# Altium project AFE_mezzanine.PrjPCB
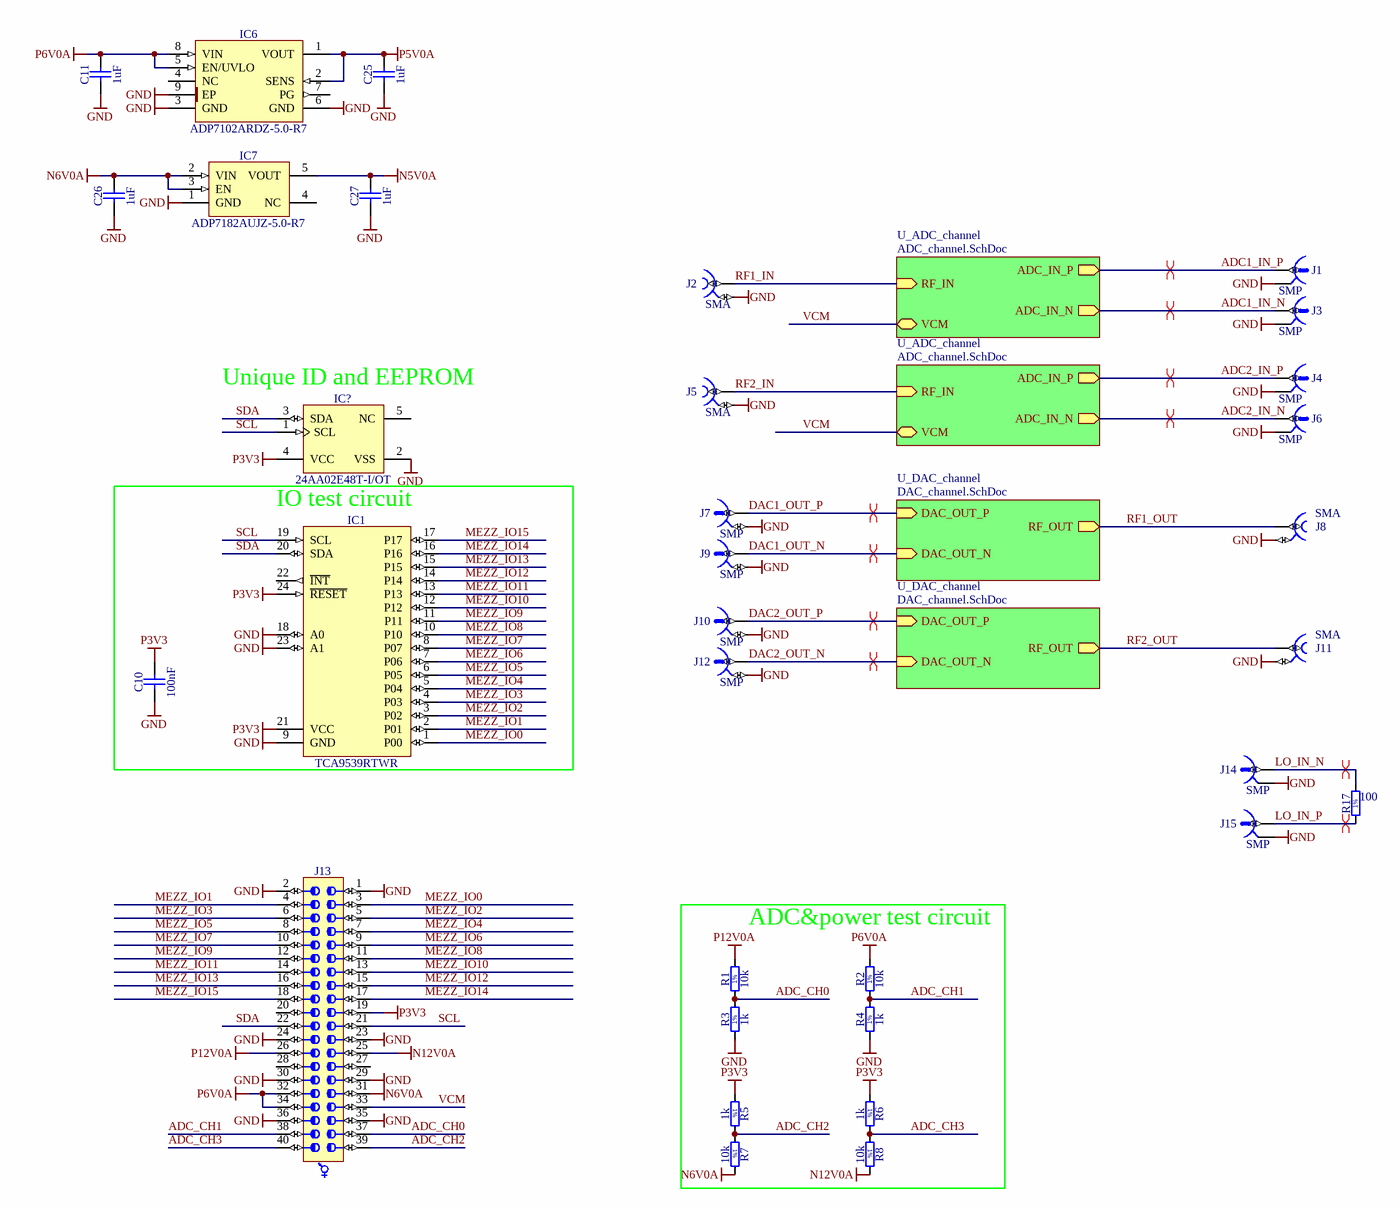
[diagram p0: AFE_mezzanine.SchDoc]
3 sheets, 73 parts. Net scope: hierarchical (ports join the sheet entries above them; power ports are global).
Board file: AFE_mezzanine.PcbDoc
Sheets:
  AFE_mezzanine.SchDoc
    U_ADC_channel = ADC_channel.SchDoc
    U_DAC_channel = DAC_channel.SchDoc
    U_ADC_channel = ADC_channel.SchDoc
    U_DAC_channel = DAC_channel.SchDoc

## Sheet AFE_mezzanine.SchDoc: ADC/DAC mezzanine
size 420 x 297 mm; Author: G.K.; CompanyName: WUT; DrawnBy: G.K.; Organization: CERN; Address1: Warsaw Univeristy of Technology; Address2: Nowowiejska 15/19; Revision: -; SheetNumber: -; SheetTotal: -; EDA_Number: ARTIQ; Projet: ADC/DAC MEZZANINE; ModifiedBy: -; CreateDate: XX/XX/XXXX; CheckedDate: -; Title2: Top entity; DivGrp: ISE; Designer: G.K.; ModifiedDate: -; ProjectName: ADC/DAC MEZZANINE

### Parts
C10  100nF  [CAPC1005X55N]
C11  1uF  [CAPC2012X140N]
C25  1uF  [CAPC2012X140N]
C26  1uF  [CAPC2012X140N]
C27  1uF  [CAPC2012X140N]
IC1  TCA9539RTWR  [QFN50P400X400X80-25N-S255]
IC6  ADP7102ARDZ-5.0-R7  [SOIC127P600X175-9N-R241X309]
IC7  ADP7182AUJZ-5.0-R7  [SOT95P280X90-5N]
IC?  24AA02E48T-I/OT  [SOT95P280X145-5N]
J1  SMP  [AMPHENOL_SMP-MSLD-PCT-10]
J2  SMA  [Telegartner_J01151A0921]
J3  SMP  [AMPHENOL_SMP-MSLD-PCT-10]
J4  SMP  [AMPHENOL_SMP-MSLD-PCT-10]
J5  SMA  [Telegartner_J01151A0921]
J6  SMP  [AMPHENOL_SMP-MSLD-PCT-10]
J7  SMP  [MOLEX_85305-0232]
J8  SMA  [TELEGARTNER_J01151A0451]
J9  SMP  [MOLEX_85305-0232]
J10  SMP  [MOLEX_85305-0232]
J11  SMA  [TELEGARTNER_J01151A0451]
J12  SMP  [MOLEX_85305-0232]
J13  (no value)  [SAMTEC_LSS-120-03-L-DV-A]
J14  SMP  [AMPHENOL_SMP-MSLD-PCT-10]
J15  SMP  [AMPHENOL_SMP-MSLD-PCT-10]
R1  10k  [RESC1005X40N]
R2  10k  [RESC1005X40N]
R3  1k  [RESC1005X40N]
R4  1k  [RESC1005X40N]
R5  1k  [RESC1005X40N]
R6  1k  [RESC1005X40N]
R7  10k  [RESC1005X40N]
R8  10k  [RESC1005X40N]
R17  100  [RESC1005X40N]

### Blocks framed on the sheet
IO test circuit: C10 IC1
ADC&power test circuit: R1-R8

### Sub-sheets
U_ADC_channel = ADC_channel.SchDoc: ADC_IN_N (out), ADC_IN_P (out), RF_IN (in), VCM (bidir)
U_ADC_channel = ADC_channel.SchDoc: ADC_IN_P (out), ADC_IN_N (out), RF_IN (in), VCM (bidir)
U_DAC_channel = DAC_channel.SchDoc: DAC_OUT_P (in), DAC_OUT_N (in), RF_OUT (out)
U_DAC_channel = DAC_channel.SchDoc: DAC_OUT_P (in), DAC_OUT_N (in), RF_OUT (out)

### Nets
GND: C10.1 C11.1 C25.1 C26.1 C27.1 IC1.9(GND) IC1.18(A0) IC1.23(A1) IC6.3(GND) IC6.6(GND) IC6.9(EP) IC7.1(GND) IC?.2(VSS) J1.2 J2.2 J3.2 J4.2 J5.2 J6.2 J7.2 J8.2 J9.2 J10.2 J11.2 J12.2 J13.1 J13.2 J13.23 J13.24 J13.29 J13.30 J13.35 J13.36 J14.2 J15.2 R3.1 R4.1
N5V0A: C27.2 IC7.5(VOUT)
N6V0A: C26.2 IC7.2(VIN) IC7.3(EN) J13.31 R7.2
N12V0A: J13.25 R8.2
P3V3: C10.2 IC1.21(VCC) IC1.24(~{RESET}) IC?.4(VCC) J13.19 R5.1 R6.1
P5V0A: C25.2 IC6.1(VOUT) IC6.2(SENS)
P6V0A: C11.2 IC6.5(EN/UVLO) IC6.8(VIN) J13.32 J13.34 R2.2
P12V0A: J13.26 R1.2
ADC1_IN_N: J3.1 ; sheet U_ADC_channel/ADC_IN_N
ADC1_IN_P: J1.1 ; sheet U_ADC_channel/ADC_IN_P
ADC2_IN_N: J6.1 ; sheet U_ADC_channel/ADC_IN_N
ADC2_IN_P: J4.1 ; sheet U_ADC_channel/ADC_IN_P
ADC_CH0: J13.37 R1.1 R3.2
ADC_CH1: J13.38 R2.1 R4.2
ADC_CH2: J13.39 R5.2 R7.1
ADC_CH3: J13.40 R6.2 R8.1
DAC1_OUT_N: J9.1 ; sheet U_DAC_channel/DAC_OUT_N
DAC1_OUT_P: J7.1 ; sheet U_DAC_channel/DAC_OUT_P
DAC2_OUT_N: J12.1 ; sheet U_DAC_channel/DAC_OUT_N
DAC2_OUT_P: J10.1 ; sheet U_DAC_channel/DAC_OUT_P
LO_IN_N: J14.1 R17.2
LO_IN_P: J15.1 R17.1
MEZZ_IO0: IC1.1(P00) J13.3
MEZZ_IO1: IC1.2(P01) J13.4
MEZZ_IO2: IC1.3(P02) J13.5
MEZZ_IO3: IC1.4(P03) J13.6
MEZZ_IO4: IC1.5(P04) J13.7
MEZZ_IO5: IC1.6(P05) J13.8
MEZZ_IO6: IC1.7(P06) J13.9
MEZZ_IO7: IC1.8(P07) J13.10
MEZZ_IO8: IC1.10(P10) J13.11
MEZZ_IO9: IC1.11(P11) J13.12
MEZZ_IO10: IC1.12(P12) J13.13
MEZZ_IO11: IC1.13(P13) J13.14
MEZZ_IO12: IC1.14(P14) J13.15
MEZZ_IO13: IC1.15(P15) J13.16
MEZZ_IO14: IC1.16(P16) J13.17
MEZZ_IO15: IC1.17(P17) J13.18
RF1_IN: J2.1 ; sheet U_ADC_channel/RF_IN
RF1_OUT: J8.1 ; sheet U_DAC_channel/RF_OUT
RF2_IN: J5.1 ; sheet U_ADC_channel/RF_IN
RF2_OUT: J11.1 ; sheet U_DAC_channel/RF_OUT
SCL: IC1.19(SCL) IC?.1(SCL) J13.21
SDA: IC1.20(SDA) IC?.3(SDA) J13.22
VCM: J13.33 ; sheet U_ADC_channel/VCM, sheet U_ADC_channel/VCM

Not connected (* = marked no-connect by the designer): IC1 22(~{INT}); IC6 4(NC) 7(PG); IC7 4(NC); IC? 5(NC); J13 20 27 28

### Layout directives
differential pair: ADC1_IN_N, ADC1_IN_P, ADC2_IN_N, ADC2_IN_P, DAC1_OUT_N, DAC1_OUT_P, DAC2_OUT_N, DAC2_OUT_P, LO_IN_N, LO_IN_P

### Notes on the sheet
- (near IC?) Unique ID and EEPROM
- Project/Equipment
- Designer
- Drawn by
- Check.by
- File
- Last Mod.
- Print Date
- Sheet
- Size
- A3
- of
- Rev
- (in symbol R0402_1K_1%_0.0625W_100PPM) 1%
- (in symbol R0402_10K_1%_0.0625W_100PPM) 1%
- (in symbol R0402_100R_1%_0.0625W_100PPM) 1%

### Library data of the parts
C10 = CC0402_100NF_16V_10%_X5R: Non-polarised capacitor; Part Description: SMD Multilayer Chip Ceramic Capacitor; Manufacturer: GENERIC; Manufacturer1 Part Number: GRM155R61C104KA88D; Voltage: 16V; TC: X5R; Tolerance: ±10%; Part Number: CC0402_100NF_16V_10%_X5R; Component Kind: Standard; Component Type: Standard; Pin Count: 2; Value: 100nF; Status: None; Manufacturer Part Number: CC0402_100NF_16V_10%_X5R; Case: 0402; Mounted: Yes; Socket: No; SMD: Yes; Sense: No; Manufacturer1 Example: MURATA; Manufacturer1 ComponentHeight: 0.55mm; HelpURL: \\cern.ch\dfs\Applications\Altium\Datasheets\CC0402_X5R_MURATA_GRM.pdf; Author: CERN DEM JLC; CreateDate: 10.12.2013; LatestRevisionDate: 10.12.2013
C11 C25-C27 = CC0805_1UF_35V_20%_X7R: Non-polarised capacitor; Part Description: SMD Multilayer Chip Ceramic Capacitor; Manufacturer: GENERIC; Manufacturer1 Part Number: GMK212B7105MG-T; Voltage: 35V; TC: X7R; Tolerance: ±20%; Part Number: CC0805_1UF_35V_20%_X7R; Component Kind: Standard; Component Type: Standard; Pin Count: 2; Value: 1uF; Status: Not Recommended; Manufacturer Part Number: CC0805_1UF_35V_20%_X7R; Case: 0805; Mounted: Yes; Socket: No; SMD: Yes; Sense: No; Manufacturer1 Example: TAIYO YUDEN; Manufacturer1 ComponentHeight: 1.35mm; HelpURL: \\cern.ch\dfs\Applications\Altium\Datasheets\CC0805_X7R_TAIYO-YUDEN_HIGH-VALUE.pdf; Author: CERN DEM JLC; CreateDate: 22.06.2011; LatestRevisionDate: 22.06.2011
IC1 = TCA9539RTWR: Low-Voltage 16-Bit I2C and SMBus I/O Expander; Part Description: Low Voltage 16-Bit I2C and SMBus Low-Power I/O Expander With Interrupt Output, Reset Pin, Configuration Registers; Manufacturer: TEXAS INSTRUMENTS; PressFit: No; Bonding: No; Part Number: TCA9539RTWR; Component Kind: Standard; Component Type: Standard; Device: TCA9539RTWR; PackageDescription: QFN, 0.50mm Pitch, Square; 24 Pin, 4.00mm X 4.00mm X 0.80mm H Body (w/Thermal Tab 2.55 X 2.55 mm), IPC Medium Density; Manufacturer Part Number: TCA9539RTWR; Pin Count: 25; Case: QFN24; Mounted: Yes; Socket: No; SMD: Yes; Sense: No; ComponentHeight: 0.8mm; Author: CERN DEM MR; HelpURL: \\cern.ch\dfs\Applications\Altium\Datasheets\TCA9539RTWR.pdf; CreateDate: 01.12.2015; LatestRevisionDate: 01.12.2015
IC6 = ADP7102ARDZ-5.0-R7: 300 mA, Low Noise, CMOS LDO Linear Regulator; Part Description: 5V, 300mA, Low Noise, CMOS LDO Linear Regulator; Manufacturer: ANALOG DEVICES; PressFit: No; Bonding: No; Part Number: ADP7102ARDZ-5.0-R7; Component Kind: Standard; Component Type: Standard; Device: ADP7102ARDZ-5.0-R7; PackageDescription: SOIC 8, Pitch 1.27mm - Body 3.9x4.9mm, (w/thermal tab 2.41mm X 3.098mm), IPC Medium Density; Manufacturer Part Number: ADP7102ARDZ-5.0-R7; Pin Count: 8; Case: SOIC8; Mounted: Yes; Socket: No; SMD: Yes; Sense: No; ComponentHeight: 1.75mm; HelpURL: \\cern.ch\dfs\Applications\Altium\Datasheets\ADP7102ARDZ-5.0-R7.pdf; Author: CERN DEM JLC; CreateDate: 17.03.2014; LatestRevisionDate: 17.03.2014
IC7 = ADP7182AUJZ-5.0-R7: –5V, 200 mA, Low Noise, Linear Regulator; Part Description: –5V, -200mA, Low Noise, Linear Regulator; Manufacturer: ANALOG DEVICES; PressFit: No; Bonding: No; Part Number: ADP7182AUJZ-5.0-R7; Component Kind: Standard; Component Type: Standard; Device: ADP7182AUJZ-5.0-R7; PackageDescription: SOT23, 0.95mm pitch; 5 pin, 1.75mm W X 3.00mm L, IPC Medium Density; Manufacturer Part Number: ADP7182AUJZ-5.0-R7; Pin Count: 5; Case: SOT23-5; Mounted: Yes; Socket: No; SMD: Yes; Sense: No; ComponentHeight: 0.9mm; HelpURL: \\cern.ch\dfs\Applications\Altium\Datasheets\ADP7182AUJZ-5.0-R7.pdf; Author: CERN DEM JLC; CreateDate: 17.03.2014; LatestRevisionDate: 17.03.2014
IC? = 24AA02E48T-I/OT: 1.7V-5.5V, 2K I2C Serial EEPROM With EUI-48 Node Identity; Manufacturer: MICROCHIP TECHNOLOGY; PressFit: No; Bonding: No; Part Number: 24AA02E48T-I/OT; Component Kind: Standard; Component Type: Standard; Device: 24AA02E48T-I/OT; PackageDescription: SOT, 0.95mm pitch; 5 pin, 1.60mm W X 2.90mm L X 1.45mm H body, IPC Medium Density; Part Description: 1.7V-5.5V, 2K I2C Serial EEPROM With EUI-48 Node Identity; Manufacturer Part Number: 24AA02E48T-I/OT; Pin Count: 5; Case: SOT23-5; Mounted: Yes; Socket: No; SMD: Yes; Sense: No; ComponentHeight: 1.45mm; HelpURL: \\cern.ch\dfs\Applications\Altium\Datasheets\24AA02E48T-I-OT.pdf; Author: CERN DEM MR; CreateDate: 31.03.2016; LatestRevisionDate: 31.03.2016
J1 J3 J4 J6 J14 J15 = CON_SMP-MSLD-PCT-10: 50 Ohms, SMP Surface/THT Mount Plug, Limited Detent; Part Description: 50 Ohms, SMP Surface Mount Plug, Limited Detent; Manufacturer: AMPHENOL; PressFit: No; Part Number: AMPHENOL_SMP-MSLD-PCT-10; Component Kind: Standard; Component Type: Standard; Pin Count: 2; Family: SMP; Mounted: Yes; Socket: No; SMD: No; Sense: No; Status: None; Manufacturer Part Number: SMP-MSLD-PCT-10; ComponentHeight: 4.1mm; HelpURL: \\cern.ch\dfs\Applications\Altium\Datasheets\MOLEX_85305-0232.pdf; Author: GK; CreateDate: 11.11.2016; LatestRevisionDate: 11.11.2016
J2 J5 = SMA_RA_J01151A0921: RiSMA 50 Ohms Right Angle PCB Jack; Manufacturer: Telegartner; PressFit: No; Part Number: Telegartner_J01151A0921; Component Kind: Standard; Component Type: Standard; Pin Count: 2; Family: SMA; Mounted: Yes; Socket: No; SMD: No; Sense: No; Status: None; Part Description: SMA 50 Ohms Right Angle PCB Jack; Manufacturer Part Number: J01151A0921; ComponentHeight: 9.6mm; HelpURL: \\cern.ch\dfs\Applications\Altium\Datasheets\HUBER-SUHNER_85_SMA-50-0-101-111_NE.pdf; Author: GK; CreateDate: 11.11.2016; LatestRevisionDate: 11.11.2016
J7 J9 J10 J12 = MOLEX_85305-0232: Part Description: 50 Ohms, SMP Surface Mount Plug, Limited Detent; Manufacturer: MOLEX; PressFit: No; Part Number: MOLEX_85305-0232; Component Kind: Standard; Component Type: Standard; Pin Count: 2; Family: SMP; Mounted: Yes; Socket: No; SMD: Yes; Sense: No; Status: None; Manufacturer Part Number: 85305-0232; ComponentHeight: 4.1mm; HelpURL: \\cern.ch\dfs\Applications\Altium\Datasheets\MOLEX_85305-0232.pdf; Author: CERN DEM JMW; CreateDate: 09.08.2016; LatestRevisionDate: 09.08.2016
J8 J11 = TELEGARTNER_J01151A0451: Part Description: SMA 50 ohms Edge Mount Bulkhead Jack Receptacle; PressFit: No; Part Number: TELEGARTNER_J01151A0451; Component Kind: Standard; Component Type: Standard; Pin Count: 2; Family: SMA; Mounted: Yes; Socket: No; SMD: No; Sense: No; Status: None; Manufacturer: TELEGARTNER; Manufacturer Part Number: J01151A0451; ComponentHeight: 7mm; HelpURL: \\cern.ch\dfs\Applications\Altium\Datasheets\TELEGARTNER_J01151A0451.pdf; Author: CERN DEM JLC; CreateDate: 27.10.2016; LatestRevisionDate: 27.10.2016
J13 = SAMTEC_LSS-120-03-L-DV-A: Connector 40 Hermaphroditic; Part Description: 40 Contacts, Pitch 0.635mm, Razor Beam LSS Vertical High Speed Hermaphroditic Strip (Lead Style 5.49mm); Manufacturer: SAMTEC; PressFit: No; Part Number: SAMTEC_LSS-120-03-L-DV-A; Component Kind: Standard; Component Type: Standard; Pin Count: 40; Mounted: Yes; Socket: No; Sense: No; SMD: Yes; Status: None; Manufacturer Part Number: LSS-120-03-L-DV-A; ComponentHeight: 5.57mm; HelpURL: \\cern.ch\dfs\Applications\Altium\Datasheets\SAMTEC_LSS-120-03-L-DV-A.pdf; Author: CERN DEM JMW; CreateDate: 10.11.2015; LatestRevisionDate: 10.11.2015
R1 R2 R7 R8 = R0402_10K_1%_0.0625W_100PPM: Resistor - 1%; Part Description: General Purpose Thick Film Chip Resistor; Manufacturer: GENERIC; Manufacturer1 Part Number: 232270671003L; TC: ±100ppm/°C; Part Number: R0402_10K_1%_0.0625W_100PPM; Component Kind: Standard; Component Type: Standard; Pin Count: 2; Value: 10k; Status: Not recommended; Power: 0.0625W; Tolerance: ±1%; Manufacturer Part Number: R0402_10K_1%_0.0625W_100PPM; Case: 0402; Mounted: Yes; Sense: No; Socket: No; SMD: Yes; Manufacturer1 Example: YAGEO PHYCOMP; Manufacturer1 ComponentHeight: 0.4mm; HelpURL: \\cern.ch\dfs\Applications\Altium\Datasheets\R0402_Phycomp_RC0402.pdf; Author: CERN DEM JLC; CreateDate: 03.12.2007; LatestRevisionDate: 17.10.2012
R3-R6 = R0402_1K_1%_0.0625W_100PPM: Resistor - 1%; Part Description: General Purpose Thick Film Chip Resistor; Manufacturer: GENERIC; Manufacturer1 Part Number: 232270671002L; TC: ±100ppm/°C; Part Number: R0402_1K_1%_0.0625W_100PPM; Component Kind: Standard; Component Type: Standard; Pin Count: 2; Value: 1k; Status: Not recommended; Power: 0.0625W; Tolerance: ±1%; Manufacturer Part Number: R0402_1K_1%_0.0625W_100PPM; Case: 0402; Mounted: Yes; Sense: No; Socket: No; SMD: Yes; Manufacturer1 Example: YAGEO PHYCOMP; Manufacturer1 ComponentHeight: 0.4mm; HelpURL: \\cern.ch\dfs\Applications\Altium\Datasheets\R0402_Phycomp_RC0402.pdf; Author: CERN DEM JLC; CreateDate: 03.12.2007; LatestRevisionDate: 17.10.2012
R17 = R0402_100R_1%_0.0625W_100PPM: Resistor - 1%; Part Description: General Purpose Thick Film Chip Resistor; Manufacturer: GENERIC; Manufacturer1 Part Number: 232270671001L; TC: ±100ppm/°C; Part Number: R0402_100R_1%_0.0625W_100PPM; Component Kind: Standard; Component Type: Standard; Pin Count: 2; Value: 100; Status: Not recommended; Power: 0.0625W; Tolerance: ±1%; Manufacturer Part Number: R0402_100R_1%_0.0625W_100PPM; Case: 0402; Mounted: Yes; Sense: No; Socket: No; SMD: Yes; Manufacturer1 Example: YAGEO PHYCOMP; Manufacturer1 ComponentHeight: 0.4mm; HelpURL: \\cern.ch\dfs\Applications\Altium\Datasheets\R0402_Phycomp_RC0402.pdf; Author: CERN DEM JLC; CreateDate: 03.12.2007; LatestRevisionDate: 17.10.2012

## Sheet ADC_channel.SchDoc
size A4
Used 2 times, as channels U_ADC_channel, U_ADC_channel. Parts and nets are listed once, with the designators drawn on the sheet.
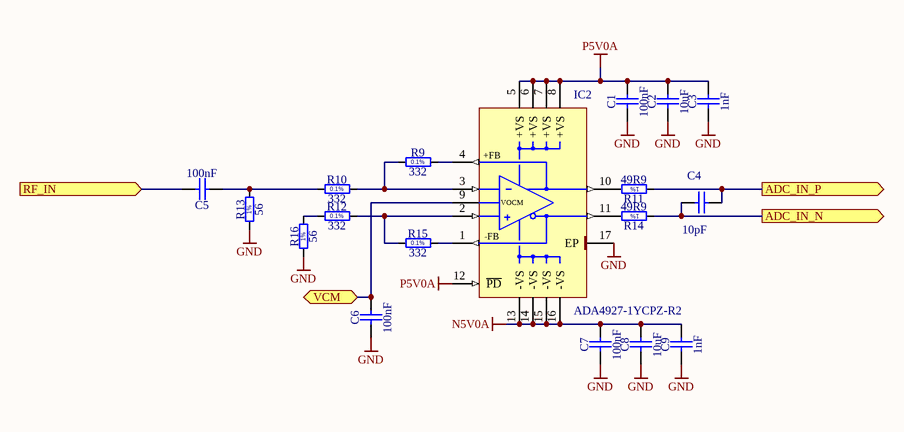
[diagram p1: ADC_channel.SchDoc]

### Parts
C1  100nF  [CAPC1005X55N]
C2  10uF  [CAPC1608X87N]
C3  1nF  [CAPC1005X55N]
C4  10pF  [CAPC1608X87N]
C5  100nF  [CAPC1005X55N]
C6  100nF  [CAPC1005X55N]
C7  100nF  [CAPC1005X55N]
C8  10uF  [CAPC1608X87N]
C9  1nF  [CAPC1005X55N]
IC2  ADA4927-1YCPZ-R2  [QFN50P300X300X100-17N-S145]
R9  332  [RESC1608X55N]
R10  332  [RESC1608X55N]
R11  49R9  [RESC1005X40N]
R12  332  [RESC1608X55N]
R13  56  [RESC1005X40N]
R14  49R9  [RESC1005X40N]
R15  332  [RESC1608X55N]
R16  56  [RESC1005X40N]

### Ports
ADC_IN_N (out), ADC_IN_P (out), RF_IN (in), VCM (bidir)

### Nets
GND: C1.1 C2.1 C3.1 C6.1 C7.1 C8.1 C9.1 IC2.17(EP) R13.1 R16.1
N5V0A: C7.2 C8.2 C9.2 IC2.13(-VS) IC2.14(-VS) IC2.15(-VS) IC2.16(-VS)
P5V0A: C1.2 C2.2 C3.2 IC2.5(+VS) IC2.6(+VS) IC2.7(+VS) IC2.8(+VS) IC2.12(~{PD})
ADC_IN_N: C4.1 R14.1 ; port ADC_IN_N
ADC_IN_P: C4.2 R11.1 ; port ADC_IN_P
RF_IN: C5.2 ; port RF_IN
VCM: C6.2 IC2.9(VOCM) ; port VCM
NetC5_1: C5.1 R10.1 R13.2
NetIC2_1: IC2.1(-FB) R15.2
NetIC2_2: IC2.2(+IN) R12.2 R15.1
NetIC2_3: IC2.3(-IN) R9.1 R10.2
NetIC2_4: IC2.4(+FB) R9.2
NetIC2_10: IC2.10(+OUT) R11.2
NetIC2_11: IC2.11(-OUT) R14.2
NetR12_1: R12.1 R16.2

### Channels
U_ADC_channel: designators end in B; ports ADC_IN_N=ADC1_IN_N ADC_IN_P=ADC1_IN_P RF_IN=RF1_IN VCM=VCM
U_ADC_channel: designators end in A; ports ADC_IN_N=ADC2_IN_N ADC_IN_P=ADC2_IN_P RF_IN=RF2_IN VCM=VCM

### Notes on the sheet
- (in symbol R0402_49R9_1%_0.0625W_100PPM) 1%
- (in symbol R0402_56R_1%_0.0625W_100PPM) 1%
- (in symbol R0603_332R_0.1%_0.063W_10PPM) 0.1%

### Library data of the parts
C1 C5-C7 = CC0402_100NF_16V_10%_X5R: as C10 on sheet AFE_mezzanine; Part Number: CC0402_100NF_16V_10%_X5R; Component Kind: Standard; Component Type: Standard; Pin Count: 2; Value: 100nF; Status: None; Manufacturer Part Number: CC0402_100NF_16V_10%_X5R; Case: 0402; Mounted: Yes; Socket: No; SMD: Yes; Sense: No; Manufacturer1 Example: MURATA; Manufacturer1 ComponentHeight: 0.55mm; HelpURL: \\cern.ch\dfs\Applications\Altium\Datasheets\CC0402_X5R_MURATA_GRM.pdf; Author: CERN DEM JLC; CreateDate: 10.12.2013; LatestRevisionDate: 10.12.2013
C2 C8 = CC0603_10UF_6.3V_20%_X5R: Non-polarised capacitor; Part Description: SMD Multilayer Chip Ceramic Capacitor; Manufacturer: GENERIC; Manufacturer1 Part Number: C0603C106M9PAC; Voltage: 6.3V; TC: X5R; Tolerance: ±20%; Part Number: CC0603_10UF_6.3V_20%_X5R; Component Kind: Standard; Component Type: Standard; Pin Count: 2; Value: 10uF; Status: Preferred; Manufacturer Part Number: CC0603_10uF_6.3V_20%_X5R; Case: 0603; Mounted: Yes; Socket: No; SMD: Yes; Sense: No; Manufacturer1 Example: KEMET; Manufacturer1 ComponentHeight: 0.95mm; HelpURL: \\cern.ch\dfs\Applications\Altium\Datasheets\CC0603_X5R_KEMET.pdf; Author: CERN DEM JLC; CreateDate: 03.12.2007; LatestRevisionDate: 03.12.2007
C3 C9 = CC0402_1NF_50V_10%_X7R: Non-polarised capacitor; Part Description: SMD Multilayer Chip Ceramic Capacitor; Manufacturer: GENERIC; Manufacturer1 Part Number: 223858715623; Voltage: 50V; TC: X7R; Tolerance: ±10%; Part Number: CC0402_1NF_50V_10%_X7R; Component Kind: Standard; Component Type: Standard; Pin Count: 2; Value: 1nF; Status: Not Recommended; Manufacturer Part Number: CC0402_1NF_50V_10%_X7R; Case: 0402; Mounted: Yes; Socket: No; SMD: Yes; Sense: No; Manufacturer1 Example: PHYCOMP; Manufacturer1 ComponentHeight: 0.55mm; HelpURL: \\cern.ch\dfs\Applications\Altium\Datasheets\CC0402_X7R_PHYCOMP.pdf; Author: CERN DEM JLC; CreateDate: 03.12.2007; LatestRevisionDate: 03.12.2007
C4 = CC0603_10PF_50V_5%_NP0: Non-polarised capacitor; Part Description: SMD Multilayer Chip Ceramic Capacitor; Manufacturer: GENERIC; Manufacturer1 Part Number: 223886715109; Voltage: 50V; TC: C0G/NP0; Tolerance: ±5%; Part Number: CC0603_10PF_50V_5%_NP0; Component Kind: Standard; Component Type: Standard; Pin Count: 2; Value: 10pF; Status: Preferred; Manufacturer Part Number: CC0603_10PF_50V_5%_NP0; Case: 0603; Mounted: Yes; Socket: No; SMD: Yes; Sense: No; Manufacturer1 Example: PHYCOMP; Manufacturer1 ComponentHeight: 0.87mm; HelpURL: \\cern.ch\dfs\Applications\Altium\Datasheets\CC0603_NP0_PHYCOMP.pdf; Author: CERN DEM JLC; CreateDate: 03.12.2007; LatestRevisionDate: 03.12.2007
IC2 = ADA4927-1YCPZ-R2: Ultralow Distortion Current Feedback Differential ADC Driver; Manufacturer: ANALOG DEVICES; PressFit: No; Bonding: No; Part Number: ADA4927-1YCPZ-R2; Component Kind: Standard; Component Type: Standard; Device: ADA4927-1YCPZ-R2; PackageDescription: QFN,0.50mm pitch,square; 4 pin X 4 pin, 3mm X 3mm X 1.00mm H body (w/thermal tab 1.45 X 1.45mm),  IPC Medium Density; Part Description: Ultralow Distortion Current Feedback Differential ADC Driver; Manufacturer Part Number: ADA4927-1YCPZ-R2; Pin Count: 17; Case: QFN16; Mounted: Yes; Socket: No; SMD: Yes; Sense: No; ComponentHeight: 1mm; Author: CERN DEM JLC; HelpURL: \\cern.ch\dfs\Applications\Altium\Datasheets\ADA4927-1YCPZ-R2.pdf; CreateDate: 19.04.2010; LatestRevisionDate: 19.04.2010
R9 R10 R12 R15 = R0603_332R_0.1%_0.063W_10PPM: Resistor - 0.1%; Part Description: Thin Film Chip Resistor; Manufacturer: GENERIC; Manufacturer1 Part Number: RN73C1J332RBTDF; Power: 0.063W; TC: ±10ppm; Part Number: R0603_332R_0.1%_0.063W_10PPM; Component Kind: Standard; Component Type: Standard; Pin Count: 2; Value: 332; Status: Not recommended; Tolerance: ±0.1%; Manufacturer Part Number: R0603_332R_0.1%_0.063W_10PPM; Case: 0603; Mounted: Yes; Sense: No; Socket: No; SMD: Yes; Manufacturer1 Example: TYCO HOLSWORTHY; Manufacturer1 ComponentHeight: 0.5mm; HelpURL: \\cern.ch\dfs\Applications\Altium\Datasheets\R0603_Tyco_RN73.pdf; Author: CERN DEM JLC; CreateDate: 03.12.2007; LatestRevisionDate: 13.03.2008
R11 R14 = R0402_49R9_1%_0.0625W_100PPM: Resistor - 1%; Part Description: General Purpose Thick Film Chip Resistor; Manufacturer: GENERIC; Manufacturer1 Part Number: 232270674999L or RC0402FR-0749R9L; TC: ±100ppm/°C; Part Number: R0402_49R9_1%_0.0625W_100PPM; Component Kind: Standard; Component Type: Standard; Pin Count: 2; Value: 49R9; Status: Not recommended; Power: 0.0625W; Tolerance: ±1%; Manufacturer Part Number: R0402_49R9_1%_0.0625W_100PPM; Case: 0402; Mounted: Yes; Sense: No; Socket: No; SMD: Yes; Manufacturer1 Example: YAGEO PHYCOMP; Manufacturer1 ComponentHeight: 0.4mm; HelpURL: \\cern.ch\dfs\Applications\Altium\Datasheets\R0402_Phycomp_RC0402.pdf; Author: CERN DEM JLC; CreateDate: 24.10.2012; LatestRevisionDate: 24.10.2012
R13 R16 = R0402_56R_1%_0.0625W_100PPM: Resistor - 1%; Part Description: General Purpose Thick Film Chip Resistor; Manufacturer: GENERIC; Manufacturer1 Part Number: 232270675609L; TC: ±100ppm/°C; Part Number: R0402_56R_1%_0.0625W_100PPM; Component Kind: Standard; Component Type: Standard; Pin Count: 2; Value: 56; Status: Not recommended; Power: 0.0625W; Tolerance: ±1%; Manufacturer Part Number: R0402_56R_1%_0.0625W_100PPM; Case: 0402; Mounted: Yes; Sense: No; Socket: No; SMD: Yes; Manufacturer1 Example: YAGEO PHYCOMP; Manufacturer1 ComponentHeight: 0.4mm; HelpURL: \\cern.ch\dfs\Applications\Altium\Datasheets\R0402_Phycomp_RC0402.pdf; Author: CERN DEM JLC; CreateDate: 03.12.2007; LatestRevisionDate: 17.10.2012

## Sheet DAC_channel.SchDoc: DAC
size 420 x 297 mm; Author: G.K.; CompanyName: WUT; DrawnBy: G.K.; Organization: CERN; Address1: Warsaw Univeristy of Technology; Address2: Nowowiejska 15/19; Revision: -; SheetNumber: -; SheetTotal: -; EDA_Number: ARTIQ; Projet: ADC/DAC MEZZANINE; ModifiedBy: -; CreateDate: XX/XX/XXXX; CheckedDate: -; Title2: Output channel; DivGrp: ISE; Designer: G.K.; ModifiedDate: -; ProjectName: ADC/DAC MEZZANINE
Used 2 times, as channels U_DAC_channel, U_DAC_channel. Parts and nets are listed once, with the designators drawn on the sheet.
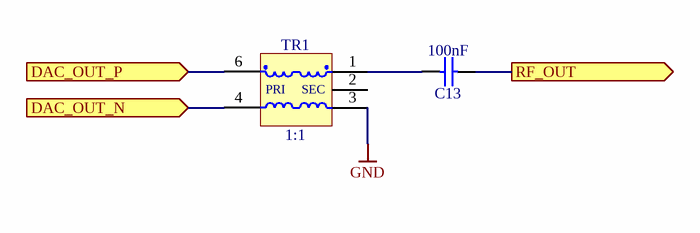
[diagram p2: DAC_channel.SchDoc]

### Parts
C13  100nF  [CAPC1608X87N]
TR1  1:1  [XFMR_MINI-CIRCUITS_AT224]

### Ports
DAC_OUT_N (in), DAC_OUT_P (in), RF_OUT (out)

### Nets
GND: TR1.3(S)
DAC_OUT_N: TR1.4(P) ; port DAC_OUT_N
DAC_OUT_P: TR1.6(PDOT) ; port DAC_OUT_P
RF_OUT: C13.1 ; port RF_OUT
NetC13_2: C13.2 TR1.1(SDOT)

Not connected (* = marked no-connect by the designer): TR1 2(NC)

### Channels
U_DAC_channel: designators end in B; ports DAC_OUT_N=DAC1_OUT_N DAC_OUT_P=DAC1_OUT_P RF_OUT=RF1_OUT
U_DAC_channel: designators end in A; ports DAC_OUT_N=DAC2_OUT_N DAC_OUT_P=DAC2_OUT_P RF_OUT=RF2_OUT

### Notes on the sheet
- Project/Equipment
- Designer
- Drawn by
- Check.by
- File
- Last Mod.
- Print Date
- Sheet
- Size
- A3
- of
- Rev
- (in symbol XFMR_MINI-CIRCUITS_TC1-1-13M+) PRI; SEC

### Library data of the parts
C13 = CC0603_100NF_50V_10%_X7R: Non-polarised capacitor; Part Description: SMD Multilayer Chip Ceramic Capacitor; Manufacturer: GENERIC; Manufacturer1 Part Number: 223858615649; Voltage: 50V; TC: X7R; Tolerance: ±10%; Part Number: CC0603_100NF_50V_10%_X7R; Component Kind: Standard; Component Type: Standard; Pin Count: 2; Value: 100nF; Status: Preferred; Manufacturer Part Number: CC0603_100NF_50V_10%_X7R; Case: 0603; Mounted: Yes; Socket: No; SMD: Yes; Sense: No; Manufacturer1 Example: PHYCOMP; Manufacturer1 ComponentHeight: 0.87mm; HelpURL: \\cern.ch\dfs\Applications\Altium\Datasheets\CC0603_X7R_PHYCOMP.pdf; Author: CERN DEM JLC; CreateDate: 03.12.2007; LatestRevisionDate: 03.12.2007
TR1 = XFMR_MINI-CIRCUITS_TC1-1-13M+: 50 Ohms 4.5 To 3000MHz RF Transformers; Part Number: XFMR_MINI-CIRCUITS_TC1-1-13M+; Component Kind: Standard; Component Type: Standard; Pin Count: 5; Value: 1:1; Status: None; Part Description: 50 Ohms 4.5 To 3000MHz RF Transformer; Manufacturer: MINI-CIRCUITS; Manufacturer Part Number: TC1-1-13M+; Mounted: Yes; Socket: No; Sense: No; SMD: Yes; ComponentHeight: 3.81mm; HelpURL: \\cern.ch\dfs\Applications\Altium\Datasheets\XFMR_MINI-CIRCUITS_TC1-1-13M+.pdf; Author: CERN DEM JLC; CreateDate: 30.11.2011; LatestRevisionDate: 30.11.2011

## Nets that join several sheets
GND: AFE_mezzanine (37 pins), U_ADC_channel (10 pins), U_DAC_channel (TR1B.3), U_ADC_channel (10 pins), U_DAC_channel (TR1A.3)
N5V0A: AFE_mezzanine (C27.2 IC7.5), U_ADC_channel (7 pins), U_ADC_channel (7 pins)
P5V0A: AFE_mezzanine (C25.2 IC6.1 IC6.2), U_ADC_channel (8 pins), U_ADC_channel (8 pins)
ADC1_IN_N: AFE_mezzanine (J3.1), U_ADC_channel (C4B.1 R14B.1)
ADC1_IN_P: AFE_mezzanine (J1.1), U_ADC_channel (C4B.2 R11B.1)
ADC2_IN_N: AFE_mezzanine (J6.1), U_ADC_channel (C4A.1 R14A.1)
ADC2_IN_P: AFE_mezzanine (J4.1), U_ADC_channel (C4A.2 R11A.1)
DAC1_OUT_N: AFE_mezzanine (J9.1), U_DAC_channel (TR1B.4)
DAC1_OUT_P: AFE_mezzanine (J7.1), U_DAC_channel (TR1B.6)
DAC2_OUT_N: AFE_mezzanine (J12.1), U_DAC_channel (TR1A.4)
DAC2_OUT_P: AFE_mezzanine (J10.1), U_DAC_channel (TR1A.6)
RF1_IN: AFE_mezzanine (J2.1), U_ADC_channel (C5B.2)
RF1_OUT: AFE_mezzanine (J8.1), U_DAC_channel (C13B.1)
RF2_IN: AFE_mezzanine (J5.1), U_ADC_channel (C5A.2)
RF2_OUT: AFE_mezzanine (J11.1), U_DAC_channel (C13A.1)
VCM: AFE_mezzanine (J13.33), U_ADC_channel (C6B.2 IC2B.9), U_ADC_channel (C6A.2 IC2A.9)